# Altium schematic sheet AGRSHub_Sche.SchDoc
size B
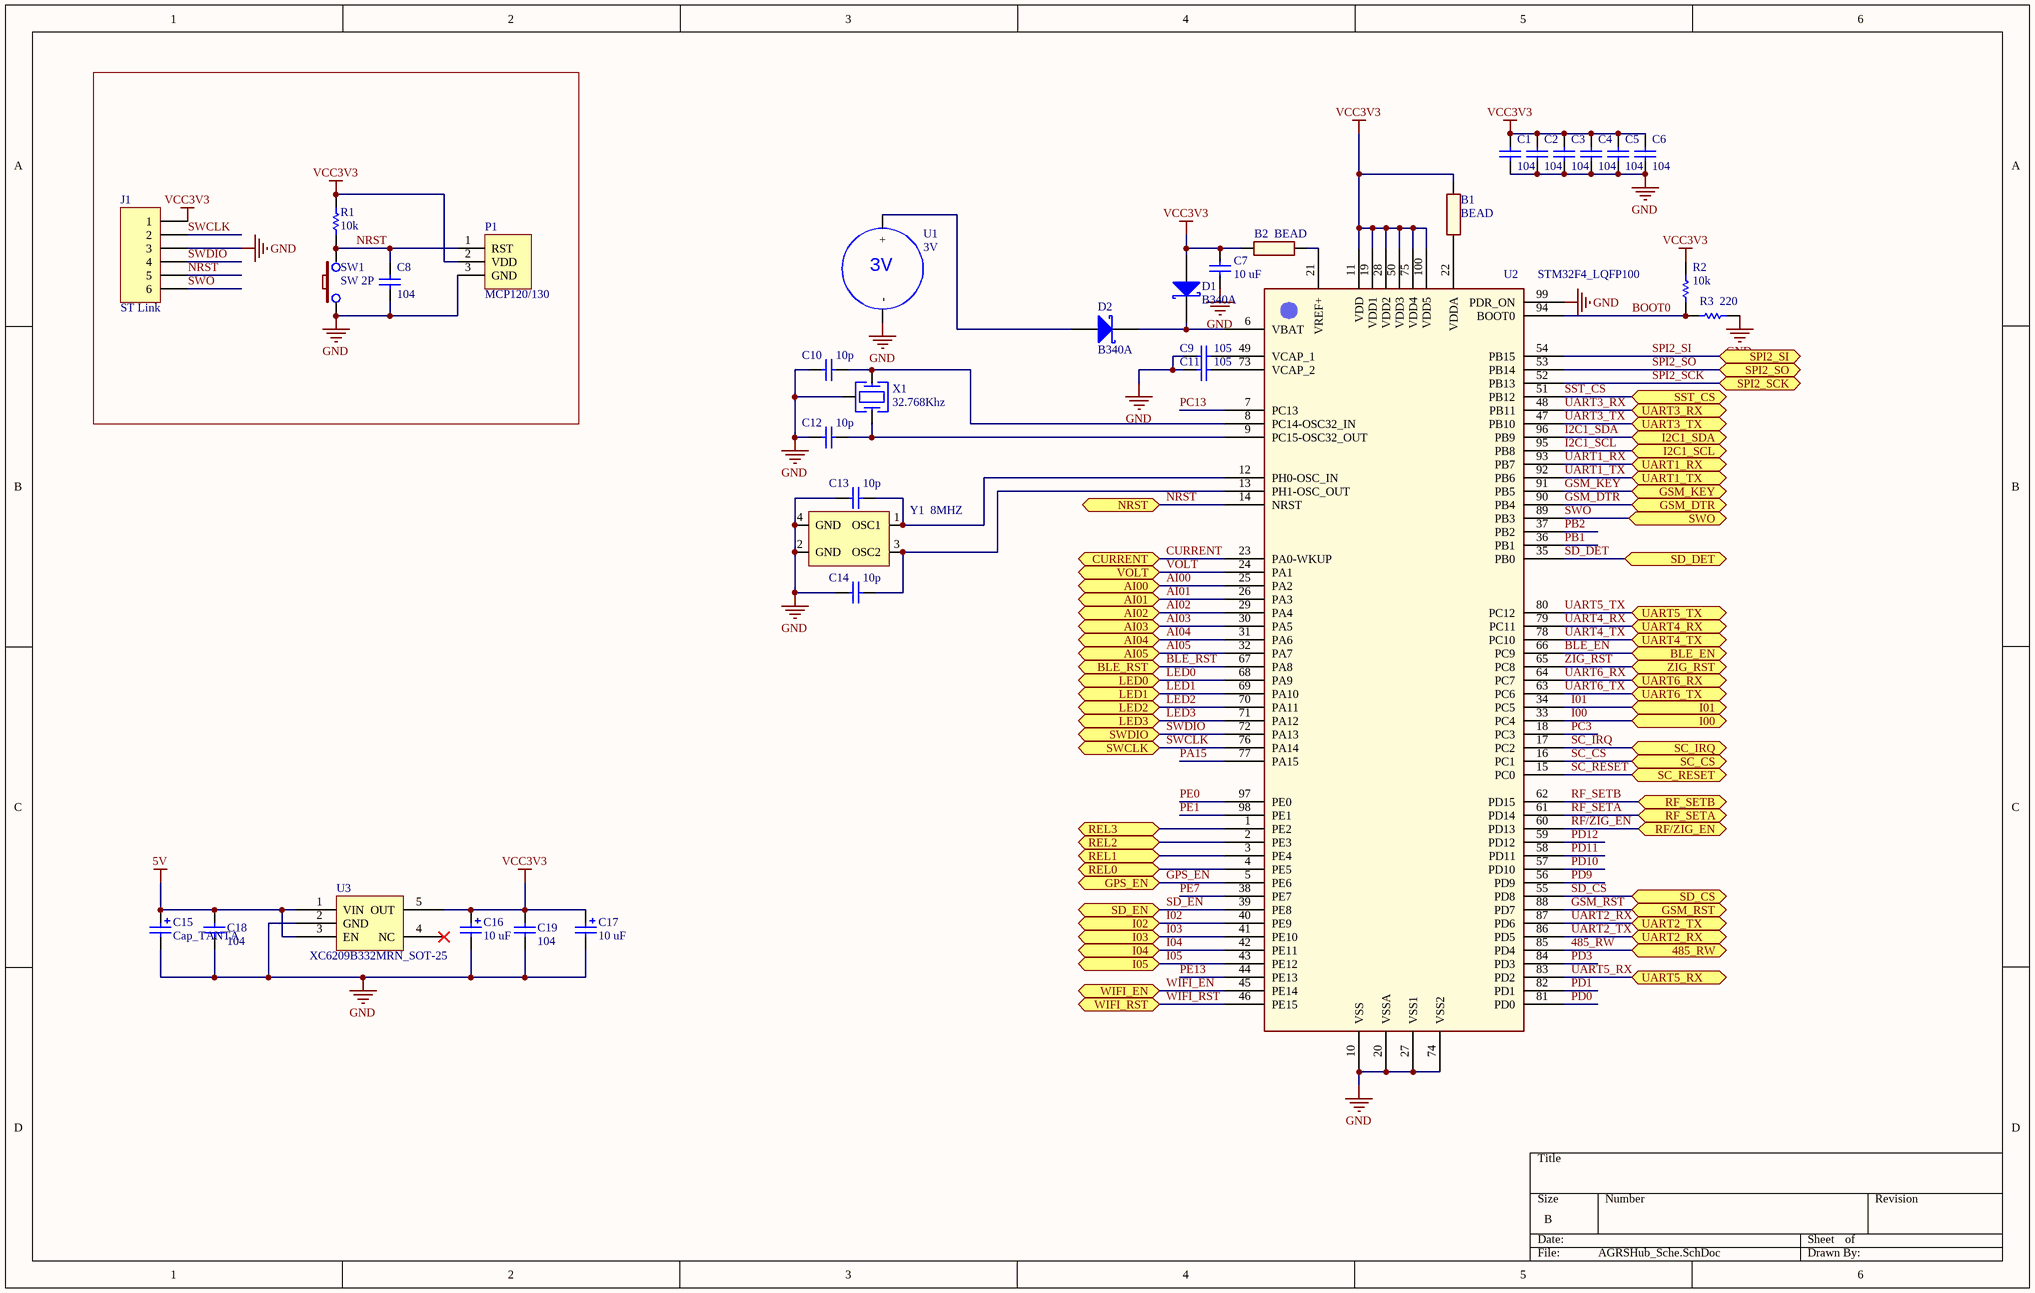
[diagram p0: AGRSHub_Sche.SchDoc]

## Parts
B1  BEAD  [0805_M]
B2  BEAD  [0805_M]
C1  104  [C0603]
C2  104  [C0603]
C3  104  [C0603]
C4  104  [C0603]
C5  104  [C0603]
C6  104  [C0603]
C7  10 uF  [C0603]
C8  104  [C0603]
C9  105  [C0603]
C10  10p  [C0603]
C11  105  [C0603]
C12  10p  [C0603]
C13  10p  [C0603]
C14  10p  [C0603]
C15  Cap_TANTA  [CAP_TANTA_SMD_10UF/10V/16V]
C16  10 uF  [CAP_TANTA_SMD_10UF/10V/16V]
C17  10 uF  [CAP_TANTA_SMD_10UF/10V/16V]
C18  104  [C0603]
C19  104  [C0603]
D1  B340A  [DO_213AA]
D2  B340A  [DO_213AA]
J1  ST Link  [HEADER 6]
P1  MCP120/130  [SOT23-3]
R1  10k  [R0603]
R2  10k  [R0603]
R3  220  [R0603]
SW1  SW 2P  [SW TACT]
U1  3V  [BAT CR1220 Holder]
U2  STM32F4_LQFP100  [TSQFP50P1600X1600X160-100N]
U3  XC6209B332MRN_SOT-25  [SOT23-5]
X1  value 32.768Khz  [Crystal cylinder]  (hidden comment: Crystal1)
Y1  8MHZ  [CRYSTAL 5032]

## Ports
485_RW, AI00, AI01, AI02, AI03, AI04, AI05, BLE_EN, BLE_RST, CURRENT, GPS_EN, GSM_DTR, GSM_KEY, GSM_RST, I00, I01, I02, I2C1_SCL, I2C1_SDA, I03, I04, I05, LED0, LED1, LED2, LED3, NRST, REL0, REL1, REL2, REL3, RF/ZIG_EN, RF_SETA, RF_SETB, SC_CS, SC_IRQ, SC_RESET, SD_CS, SD_DET, SD_EN, SPI2_SCK, SPI2_SI, SPI2_SO, SST_CS, SWCLK, SWDIO, SWO, UART1_RX, UART1_TX, UART2_RX, UART2_TX, UART3_RX, UART3_TX, UART4_RX, UART4_TX, UART5_RX, UART5_TX, UART6_RX, UART6_TX, VOLT, WIFI_EN, WIFI_RST, ZIG_RST

## Nets
5V: C15.1 C18.2 U3.1(VIN) U3.3(EN)
GND: C1.1 C2.1 C3.1 C4.1 C5.1 C6.1 C7.1 C8.1 C9.2 C10.2 C11.2 C12.2 C13.1 C14.1 C15.2 C16.2 C17.2 C18.1 C19.1 J1.3 P1.3(GND) R3.2 SW1.1 U1.2(-) U2.10(VSS) U2.20(VSSA) U2.27(VSS1) U2.74(VSS2) U2.99(PDR_ON) U3.2(GND) X1.3(GND) Y1.2(GND) Y1.4(GND)
VCC3V3: B1.1 B2.1 C1.2 C2.2 C3.2 C4.2 C5.2 C6.2 C7.2 C16.1 C17.1 C19.2 D1.1(A) J1.1 P1.2(VDD) R1.2 R2.2 U2.11(VDD) U2.19(VDD1) U2.28(VDD2) U2.50(VDD3) U2.75(VDD4) U2.100(VDD5) U3.5(OUT)
485_RW: U2.85(PD4) ; port 485_RW
AI00: U2.25(PA2) ; port AI00
AI01: U2.26(PA3) ; port AI01
AI02: U2.29(PA4) ; port AI02
AI03: U2.30(PA5) ; port AI03
AI04: U2.31(PA6) ; port AI04
AI05: U2.32(PA7) ; port AI05
BLE_EN: U2.66(PC9) ; port BLE_EN
BLE_RST: U2.67(PA8) ; port BLE_RST
BOOT0: R2.1 R3.1 U2.94(BOOT0)
CURRENT: U2.23(PA0-WKUP) ; port CURRENT
GPS_EN: U2.5(PE6) ; port GPS_EN
GSM_DTR: U2.90(PB4) ; port GSM_DTR
GSM_KEY: U2.91(PB5) ; port GSM_KEY
GSM_RST: U2.88(PD7) ; port GSM_RST
I00: U2.33(PC4) ; port I00
I01: U2.34(PC5) ; port I01
I02: U2.40(PE9) ; port I02
I2C1_SCL: U2.95(PB8) ; port I2C1_SCL
I2C1_SDA: U2.96(PB9) ; port I2C1_SDA
I03: U2.41(PE10) ; port I03
I04: U2.42(PE11) ; port I04
I05: U2.43(PE12) ; port I05
LED0: U2.68(PA9) ; port LED0
LED1: U2.69(PA10) ; port LED1
LED2: U2.70(PA11) ; port LED2
LED3: U2.71(PA12) ; port LED3
NRST: C8.2 J1.5 P1.1(RST) R1.1 SW1.2 U2.14(NRST) ; port NRST
PA15: U2.77(PA15)
PB1: U2.36(PB1)
PB2: U2.37(PB2)
PC3: U2.18(PC3)
PC13: U2.7(PC13)
PD0: U2.81(PD0)
PD1: U2.82(PD1)
PD3: U2.84(PD3)
PD9: U2.56(PD9)
PD10: U2.57(PD10)
PD11: U2.58(PD11)
PD12: U2.59(PD12)
PE0: U2.97(PE0)
PE1: U2.98(PE1)
PE7: U2.38(PE7)
PE13: U2.44(PE13)
REL0: U2.4(PE5) ; port REL0
REL1: U2.3(PE4) ; port REL1
REL2: U2.2(PE3) ; port REL2
REL3: U2.1(PE2) ; port REL3
RF/ZIG_EN: U2.60(PD13) ; port RF/ZIG_EN
RF_SETA: U2.61(PD14) ; port RF_SETA
RF_SETB: U2.62(PD15) ; port RF_SETB
SC_CS: U2.16(PC1) ; port SC_CS
SC_IRQ: U2.17(PC2) ; port SC_IRQ
SC_RESET: U2.15(PC0) ; port SC_RESET
SD_CS: U2.55(PD8) ; port SD_CS
SD_DET: U2.35(PB0) ; port SD_DET
SD_EN: U2.39(PE8) ; port SD_EN
SPI2_SCK: U2.52(PB13) ; port SPI2_SCK
SPI2_SI: U2.54(PB15) ; port SPI2_SI
SPI2_SO: U2.53(PB14) ; port SPI2_SO
SST_CS: U2.51(PB12) ; port SST_CS
SWCLK: J1.2 U2.76(PA14) ; port SWCLK
SWDIO: J1.4 U2.72(PA13) ; port SWDIO
SWO: J1.6 U2.89(PB3) ; port SWO
UART1_RX: U2.93(PB7) ; port UART1_RX
UART1_TX: U2.92(PB6) ; port UART1_TX
UART2_RX: U2.87(PD6) ; port UART2_TX
UART2_TX: U2.86(PD5) ; port UART2_RX
UART3_RX: U2.48(PB11) ; port UART3_RX
UART3_TX: U2.47(PB10) ; port UART3_TX
UART4_RX: U2.79(PC11) ; port UART4_RX
UART4_TX: U2.78(PC10) ; port UART4_TX
UART5_RX: U2.83(PD2) ; port UART5_RX
UART5_TX: U2.80(PC12) ; port UART5_TX
UART6_RX: U2.64(PC7) ; port UART6_RX
UART6_TX: U2.63(PC6) ; port UART6_TX
VOLT: U2.24(PA1) ; port VOLT
WIFI_EN: U2.45(PE14) ; port WIFI_EN
WIFI_RST: U2.46(PE15) ; port WIFI_RST
ZIG_RST: U2.65(PC8) ; port ZIG_RST
NetB1_2: B1.2 U2.22(VDDA)
NetB2_2: B2.2 U2.21(VREF+)
NetC9_1: C9.1 U2.49(VCAP_1)
NetC10_1: C10.1 U2.8(PC14-OSC32_IN) X1.1
NetC11_1: C11.1 U2.73(VCAP_2)
NetC12_1: C12.1 U2.9(PC15-OSC32_OUT) X1.2
NetC13_2: C13.2 U2.12(PH0-OSC_IN) Y1.1(OSC1)
NetC14_2: C14.2 U2.13(PH1-OSC_OUT) Y1.3(OSC2)
NetD1_2: D1.2(K) D2.2(K) U2.6(VBAT)
NetD2_1: D2.1(A) U1.1(+)

Not connected (* = marked no-connect by the designer): U3 4(NC)*

## Library data of the parts
C1-C14 C18 C19 = Cap_SMT: CAP CER 0.1UF 16V Y5V 0402; Manufacturer: Yageo; Manufacturer Part Number: CC0603ZRY5V7BB104; Published: 8-Jun-2000; LatestRevisionDate: 17-Jul-2002; LatestRevisionNote: Re-released for DXP Platform.; PackageReference: C0603; Publisher: Altium Limited; Digi-Key Part Number: 311-1047-1-ND; Unit Price: 0.00648
  C1-C6 C8 C18 C19: Value: 104
  C7: Value: 10 uF
  C9 C11: Value: 105
  C10 C12-C14: Value: 10p
C15-C17 = Cap_TANTA: CAP TANTA
D1 D2 = D Schottky: DIODE SCHOTTKY 40V 3A SMA; Manufacturer Part Number: B340A-E3/61T; Manufacturer: Vishay General Semiconductor; Published: 8-Jun-2000; LatestRevisionDate: 17-Jul-2002; LatestRevisionNote: Re-released for DXP Platform.; PackageReference: DO-214-AA; Publisher: Altium Limited; Code_JEDEC: DO-214-AA; Unit Price: 0.15840; Digi-Key Part Number: B340A-E3/61TGITR-ND
J1 = Header 6
R1-R3 = R_SMD1: Resistor SMD 1%; Manufacturer: Panasonic Electronic Components; Manufacturer Part Number: ERJ-2RKF3241X; Published: 8-Jun-2000; LatestRevisionDate: 17-Jul-2002; LatestRevisionNote: Re-released for DXP Platform.; PackageReference: R0603; Publisher: Altium Limited; Digi-Key Part Number: P3.24KLTR-ND; Unit Price: 0.00203
  R1 R2: Value: 10k
  R3: Value: 220
U1 = Battery Holder
U3 = XC6209B: IC REG LDO 3.3V .3A SOT-25; Digi-Key Part Number: 893-1070-2-ND
X1 = Crystal1: Tuning Forl Crystal Units (SMD-Cylinder Type); Vendor: Digikey; ComponentLink1URL: http://search.digikey.com/scripts/DkSearch/dksus.dll?Detail&name=300-2066-1-ND; ComponentLink1Description: Digikey Part Link; ComponentLink2URL: H:\LIBRARY\LIBRARY.Datasheet\k-cmr.pdf; ComponentLink2Description: Open Datasheet; Publisher: Hoang Nguyen; Published: 13-April-2009
Y1 = CRYSTAL-SMT: NX3225SA-12MHZ-STD-CSR-6; Manufacturer: TXC CORPORATION; Manufacturer Part Number: 7B-8.000MAAJ-T; Value: 8.000 MHZ; Digi-Key Part Number: 644-1180-2-ND; Unit Price: 0.39000